# EasyEDA Pro project Mini-Keyboard.eprj

# Schematic Schematic1
Board Name: Board1; Create Date: 2024-05-16; Page Name: P1; Project Name: Mini-Keyboard; Schematic Name: Schematic1; Update Date: 2024-11-25; Company: 嘉立创EDA; Page Size: A3; Version: V1.0
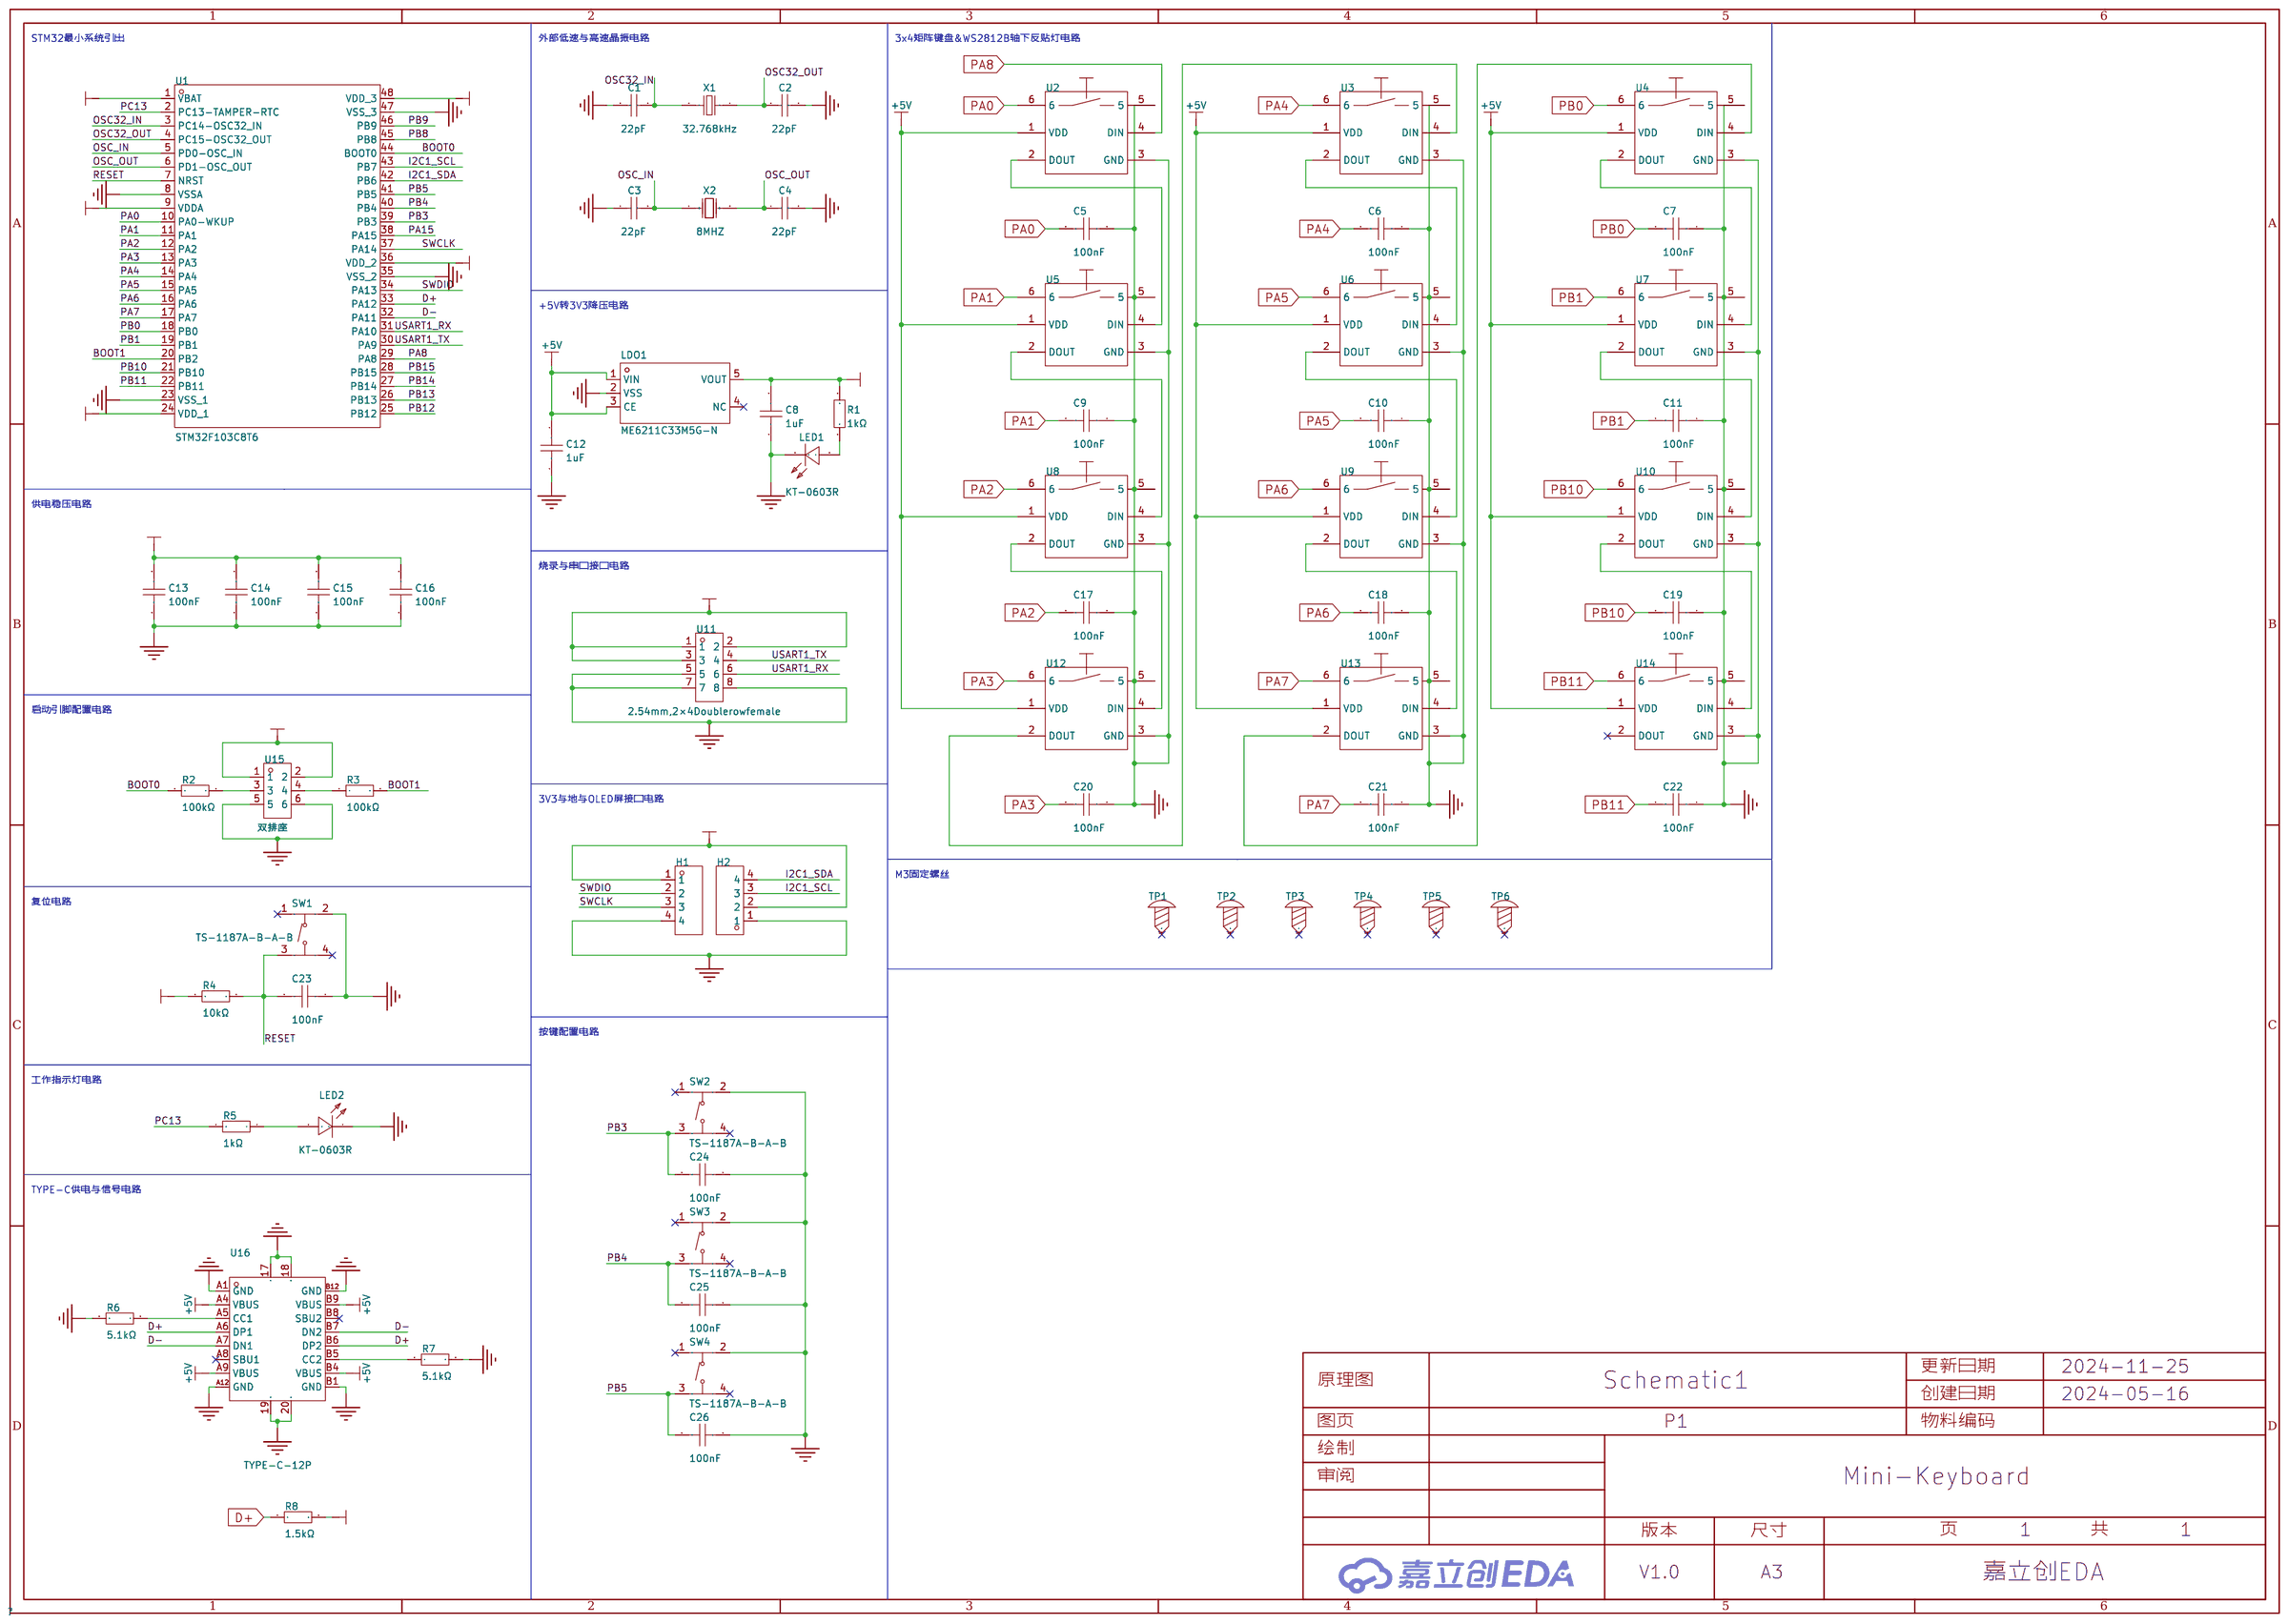
[diagram p0: schematic sheet]

## Parts
C1  22pF  [C0603]
C2  22pF  [C0603]
C3  22pF  [C0603]
C4  22pF  [C0603]
C5  100nF  [C0603]
C6  100nF  [C0603]
C7  100nF  [C0603]
C8  1uF  [C0603]
C9  100nF  [C0603]
C10  100nF  [C0603]
C11  100nF  [C0603]
C12  1uF  [C0603]
C13  100nF  [C0603]
C14  100nF  [C0603]
C15  100nF  [C0603]
C16  100nF  [C0603]
C17  100nF  [C0603]
C18  100nF  [C0603]
C19  100nF  [C0603]
C20  100nF  [C0603]
C21  100nF  [C0603]
C22  100nF  [C0603]
C23  100nF  [C0603]
C24  100nF  [C0603]
C25  100nF  [C0603]
C26  100nF  [C0603]
H1  -  [hdr-th_4p-p2.54-v-f]
H2  -  [hdr-th_4p-p2.54-v-f]
LDO1  ME6211C33M5G-N  [SOT-23-5_L3.0-W1.7-P0.95-LS2.8-BL]
LED1  KT-0603R  [LED0603-RD]
LED2  KT-0603R  [LED0603-RD]
R1  1kΩ  [R0603]
R2  100kΩ  [R0603]
R3  100kΩ  [R0603]
R4  10kΩ  [R0603]
R5  1kΩ  [R0603]
R6  5.1kΩ  [R0603]
R7  5.1kΩ  [R0603]
R8  1.5kΩ  [R0603]
SW1  TS-1187A-B-A-B  [SW-SMD_4P-L5.1-W5.1-P3.70-LS6.5-TL-2]
SW2  TS-1187A-B-A-B  [SW-SMD_4P-L5.1-W5.1-P3.70-LS6.5-TL-2]
SW3  TS-1187A-B-A-B  [SW-SMD_4P-L5.1-W5.1-P3.70-LS6.5-TL-2]
SW4  TS-1187A-B-A-B  [SW-SMD_4P-L5.1-W5.1-P3.70-LS6.5-TL-2]
TP1  -  [M3螺丝]
TP2  -  [M3螺丝]
TP3  -  [M3螺丝]
TP4  -  [M3螺丝]
TP5  -  [M3螺丝]
TP6  -  [M3螺丝]
U1  STM32F103C8T6  [LQFP-48_L7.0-W7.0-P0.50-LS9.0-BL]
U2  -  [KAILH_WS2182B_3528 反贴]
U3  -  [KAILH_WS2182B_3528 反贴]
U4  -  [KAILH_WS2182B_3528 反贴]
U5  -  [KAILH_WS2182B_3528 反贴]
U6  -  [KAILH_WS2182B_3528 反贴]
U7  -  [KAILH_WS2182B_3528 反贴]
U8  -  [KAILH_WS2182B_3528 反贴]
U9  -  [KAILH_WS2182B_3528 反贴]
U10  -  [KAILH_WS2182B_3528 反贴]
U11  2.54mm,2×4Doublerowfemale  [HDR-TH_8P-P2.54-V-F-R2-C4-S2.54-1]
U12  -  [KAILH_WS2182B_3528 反贴]
U13  -  [KAILH_WS2182B_3528 反贴]
U14  -  [KAILH_WS2182B_3528 反贴]
U15  双排座  [HDR-TH_6P-P2.54-V-F-R2-C3-S2.54]
U16  TYPE-C-12P  [USB-SMD_TYPE-C16PIN]
X1  32.768kHz  [CRYSTAL-SMD_L3.2-W1.5-1]
X2  8MHZ  [HC-49S_L11.5-W5.0-P4.88]

## Library data of the parts
C1-C4 = CL10C220JB8NNNC: 容值:22pF;精度:±5%;额定电压:50V;材质(温度系数):C0G;; LCSC Part Name: 22pF ±5% 50V; Supplier Part: C1653; Manufacturer: SAMSUNG(三星); Supplier Footprint: 0603; JLCPCB Part Class: 基础库; Datasheet: https://atta.szlcsc.com/upload/public/pdf/source/20160218/1457707763339.pdf; Supplier: LCSC; Tolerance: ±5%; Voltage Rated: 50V; Temperature Coefficient: C0G
C5-C7 C9-C11 C13-C26 = CC0603KRX7R9BB104: 容值:100nF;精度:±10%;额定电压:50V;材质(温度系数):X7R;; LCSC Part Name: 100nF ±10% 50V; Supplier Part: C14663; Manufacturer: YAGEO(国巨); Supplier Footprint: 0603; JLCPCB Part Class: 基础库; Datasheet: https://atta.szlcsc.com/upload/public/pdf/source/20180910/C282072_33301C7F631E79921B82A8DAC6BCC5B3.pdf; Supplier: LCSC; Tolerance: ±10%; Voltage Rated: 50V; Temperature Coefficient: X7R
C8 C12 = CL10A105KB8NNNC: 容值:1uF;精度:±10%;额定电压:50V;材质(温度系数):X5R;; LCSC Part Name: 1uF ±10% 50V; Supplier Part: C15849; Manufacturer: SAMSUNG(三星); Supplier Footprint: 0603; JLCPCB Part Class: 基础库; Datasheet: https://atta.szlcsc.com/upload/public/pdf/source/20160218/1457707763339.pdf; Supplier: LCSC; Tolerance: ±10%; Voltage Rated: 50V; Temperature Coefficient: X5R
H1 H2 = HDR-F_2.54_1x4P: Supplier Part: C2718488; Supplier Footprint: 插件; JLCPCB Part Class: 扩展库
LDO1 = ME6211C33M5G-N: 输出类型:固定;最大输入电压:6V;输出电压:3.3V;最大输出电流:500mA;电源纹波抑制比(PSRR):70dB;输出极性:正极;; LCSC Part Name: 输入6V 输出3.3V 500mA; Supplier Part: C82942; Manufacturer: MICRONE(南京微盟); Supplier Footprint: SOT-23-5; JLCPCB Part Class: 扩展库; Datasheet: https://atta.szlcsc.com/upload/public/pdf/source/20170918/C82942_1505727073070976520.pdf; Supplier: LCSC; Output Type: 固定; Maximum Input Voltage: 6V; Output Voltage: 3.3V; MAX Output Current: 500mA; Power Supply Rejection Ratio (PSRR): 70dB; Dropout Voltage: 260mV@(200mA); Output Polarity: 正极; Number of Outputs: 1
LED1 LED2 = KT-0603R: 发光颜色:红色;功率:-;正向电流:-;主波长:-;二极管配置:-;透镜颜色:-;色温:-;发光角度:-;载带方式:-;工作温度:-40℃~+85℃;; LCSC Part Name: 0603 红灯 高亮; Supplier Part: C2286; Manufacturer: KENTO; Supplier Footprint: 0603; JLCPCB Part Class: 基础库; Datasheet: https://atta.szlcsc.com/upload/public/pdf/source/20160616/1466072038404.pdf; Supplier: LCSC; Emitted Color: 红色; Operating Temperature: -40℃~+85℃
R1 R5 = 0603WAF1001T5E: 电阻类型:厚膜电阻;阻值:1kΩ;精度:±1%;功率:100mW;最大工作电压:75V;温度系数:±100ppm/℃;; LCSC Part Name: 1kΩ ±1% 100mW 厚膜电阻; Supplier Part: C21190; Manufacturer: UNI-ROYAL(厚声); Supplier Footprint: 0603; JLCPCB Part Class: 基础库; Datasheet: https://atta.szlcsc.com/upload/public/pdf/source/20200306/C422600_1E6D84923E4A46A82E41ADD87F860B5C.pdf; Supplier: LCSC; Type: 厚膜电阻; Tolerance: ±1%; Power(Watts): 100mW; Overload Voltage (Max): 75V; Temperature Coefficient: ±100ppm/℃; Operating Temperature Range: -55℃~+155℃
R2 R3 = 0603WAF1003T5E: 电阻类型:厚膜电阻;阻值:100kΩ;精度:±1%;功率:100mW;最大工作电压:75V;温度系数:±100ppm/℃;; LCSC Part Name: 100kΩ ±1% 100mW 厚膜电阻; Supplier Part: C25803; Manufacturer: UNI-ROYAL(厚声); Supplier Footprint: 0603; JLCPCB Part Class: 基础库; Datasheet: https://atta.szlcsc.com/upload/public/pdf/source/20200306/C422600_1E6D84923E4A46A82E41ADD87F860B5C.pdf; Supplier: LCSC; Type: 厚膜电阻; Tolerance: ±1%; Power(Watts): 100mW; Overload Voltage (Max): 75V; Temperature Coefficient: ±100ppm/℃; Operating Temperature Range: -55℃~+155℃
R4 = 0603WAF1002T5E: 电阻类型:厚膜电阻;阻值:10kΩ;精度:±1%;功率:100mW;最大工作电压:75V;温度系数:±100ppm/℃;; LCSC Part Name: 厚膜电阻 10kΩ ±1% 100mW; Supplier Part: C25804; Manufacturer: UNI-ROYAL(厚声); Supplier Footprint: 0603; JLCPCB Part Class: 基础库; Datasheet: https://atta.szlcsc.com/upload/public/pdf/source/20200306/C422600_1E6D84923E4A46A82E41ADD87F860B5C.pdf; Supplier: LCSC; Type: 厚膜电阻; Tolerance: ±1%; Power(Watts): 100mW; Overload Voltage (Max): 75V; Temperature Coefficient: ±100ppm/℃; Operating Temperature Range: -55℃~+155℃
R6 R7 = 0603WAF5101T5E: 电阻类型:厚膜电阻;阻值:5.1kΩ;精度:±1%;功率:100mW;最大工作电压:75V;温度系数:±100ppm/℃;; LCSC Part Name: 5.1kΩ ±1% 100mW 厚膜电阻; Supplier Part: C23186; Manufacturer: UNI-ROYAL(厚声); Supplier Footprint: 0603; JLCPCB Part Class: 基础库; Datasheet: https://atta.szlcsc.com/upload/public/pdf/source/20200306/C422600_1E6D84923E4A46A82E41ADD87F860B5C.pdf; Supplier: LCSC; Type: 厚膜电阻; Tolerance: ±1%; Power(Watts): 100mW; Overload Voltage (Max): 75V; Temperature Coefficient: ±100ppm/℃; Operating Temperature Range: -55℃~+155℃
R8 = 0603WAF1501T5E: 电阻类型:厚膜电阻;阻值:1.5kΩ;精度:±1%;功率:100mW;最大工作电压:75V;温度系数:±100ppm/℃;; LCSC Part Name: 1.5kΩ ±1% 100mW 厚膜电阻; Supplier Part: C22843; Manufacturer: UNI-ROYAL(厚声); Supplier Footprint: 0603; JLCPCB Part Class: 基础库; Datasheet: https://atta.szlcsc.com/upload/public/pdf/source/20200306/C422600_1E6D84923E4A46A82E41ADD87F860B5C.pdf; Supplier: LCSC; Type: 厚膜电阻; Tolerance: ±1%; Power(Watts): 100mW; Overload Voltage (Max): 75V; Temperature Coefficient: ±100ppm/℃; Operating Temperature Range: -55℃~+155℃
SW1-SW4 = TS-1187A-B-A-B: 电路结构:单刀单掷;按钮形状:圆形按钮;作用力:160gf;安装方式:立贴;开关长度:5.1mm;开关宽度:5.1mm;开关高度:1.5mm;带支架:不带;触点电流:50mA;额定电压(DC):12V;绝缘电阻:-;带灯:无;机械寿命:10万次;; LCSC Part Name: 5.1*5.1*1.5mm 立贴 轻触开关; Supplier Part: C318884; Manufacturer: XKB Connectivity(中国星坤); Supplier Footprint: SMD; JLCPCB Part Class: 基础库; Datasheet: https://atta.szlcsc.com/upload/public/pdf/source/20200227/C318890_053E50208A88A7BA1965D8746000774E.pdf; Supplier: LCSC; Circuit: 单刀单掷; Actuator Style: 圆形按钮; Operating Force: 160gf; Mounting Style: 立贴; Switch Length: 5.1mm; Switch Width: 5.1mm; Switch Height: 1.5mm; Strike Gundam: 不带; Contact Current: 50mA; Voltage Rating (DC): 12V; Actuator/Cap Color: 金色; With Lamp: 无; Mechanical Life: 10万次; Operating Temperature: -30℃~+85℃
TP1-TP6 = M3螺丝: Supplier Footprint: 插件
U1 = STM32F103C8T6: CPU内核:ARM-M3;程序存储容量:64KB;RAM总容量:20KB;GPIO端口数量:37;工作电压范围:2V~3.6V;CPU最大主频:72MHz;程序存储器类型:FLASH;; Supplier Part: C8734; Manufacturer: ST(意法半导体); Supplier Footprint: LQFP-48(7x7); JLCPCB Part Class: 扩展库; Datasheet: https://atta.szlcsc.com/upload/public/pdf/source/20220812/8363ACEC51AD55ECEB84799464F7CB85.pdf; Supplier: LCSC; CPU Core: ARM-M3; Program Storage Size: 64KB; RAM Size: 20KB; GPIO Ports Number: 37; Operating Voltage Range: 2V~3.6V; CPU Maximum Speed: 72MHz; Program Memory Type: FLASH; Operating Temperature Range: -40℃~+85℃; ADC (Bit): 12bit; Universal Serial Bus: 有; Peripheral/Function: 看门狗；DMA；看门狗；温度传感器; Watchdog: 有; Infrared Data Association: 有; Low-Voltage Detect: 有; Direct Memory Access: 有; Internal Oscillator: 有
U2-U10 U12-U14 = KAILH_WS2182B_3528 反贴
U11 = 2.54mm,2×4Doublerowfemale: Supplier Part: C9900004313; JLCPCB Part Class: 扩展库; Supplier: LCSC
U15 = 双排座: Supplier Part: C9900022466; Supplier Footprint: HDR-TH-6P; JLCPCB Part Class: 扩展库; Supplier: LCSC
U16 = TYPE-C-12P: Supplier Part: C9900014866; Supplier Footprint: USB_TypeC; JLCPCB Part Class: 扩展库; Supplier: LCSC
X1 = FC31M2-32.768-NTLLLDT: 晶振类型:贴片晶振;频率:32.768kHz;常温频差:±20ppm;外接负载电容:12.5pF;频率稳定度(全温):±20ppm;; LCSC Part Name: 32.768kHz ±20ppm 12.5pF; Supplier Part: C2842180; Manufacturer: HCI(杭晶); Supplier Footprint: SMD3215-2P; JLCPCB Part Class: 扩展库; Datasheet: https://atta.szlcsc.com/upload/public/pdf/source/20220525/2E044CF849361D91E29045F083201687.pdf; Supplier: LCSC; Crystal Type: 贴片晶振; Normal temperature Frequency Tolerance: ±20ppm; External load capacitor: 12.5pF; Frequency Stability(Full temperature range): ±20ppm; Equivalent Series Resistance (ESR): 50kΩ; Operating Temperature: -40℃~+85℃
X2 = 8MHZ: Supplier Part: C9900021358; Supplier Footprint: X-HC49U直插; JLCPCB Part Class: 扩展库; Supplier: LCSC

## Nets
3V3: C8.2 C13.2 C14.2 C15.2 C16.2 H1.1 H2.2 LDO1.5(VOUT) R1.2 R4.2 R8.2 U1.1(VBAT) U1.9(VDDA) U1.24(VDD_1) U1.36(VDD_2) U1.48(VDD_3) U11.1 U11.2 U11.3 U15.1 U15.2
+5V: C12.2 LDO1.1(VIN) LDO1.3(CE) U2.1(VDD) U3.1(VDD) U4.1(VDD) U5.1(VDD) U6.1(VDD) U7.1(VDD) U8.1(VDD) U9.1(VDD) U10.1(VDD) U12.1(VDD) U13.1(VDD) U14.1(VDD) U16.A4(VBUS) U16.A9(VBUS) U16.B4(VBUS) U16.B9(VBUS)
GND: C1.1 C2.1 C3.1 C4.2 C5.1 C6.1 C7.1 C8.1 C9.1 C10.1 C11.1 C12.1 C13.1 C14.1 C15.1 C16.1 C17.1 C18.1 C19.1 C20.1 C21.1 C22.1 C23.1 C24.1 C25.1 C26.1 H1.4 H2.1 LDO1.2(VSS) LED1.1(K) LED2.1(K) R6.1 R7.2 SW1.2(B) SW2.2(B) SW3.2(B) SW4.2(B) U1.8(VSSA) U1.23(VSS_1) U1.35(VSS_2) U1.47(VSS_3) U2.3(GND) U2.5 U3.3(GND) U3.5 U4.3(GND) U4.5 U5.3(GND) U5.5 U6.3(GND) U6.5 U7.3(GND) U7.5 U8.3(GND) U8.5 U9.3(GND) U9.5 U10.3(GND) U10.5 U11.5 U11.7 U11.8 U12.3(GND) U12.5 U13.3(GND) U13.5 U14.3(GND) U14.5 U15.5 U15.6 U16.17 U16.18 U16.19 U16.20 U16.A1(GND) U16.A12(GND) U16.B1(GND) U16.B12(GND)
BOOT0: R2.1 U1.44(BOOT0)
BOOT1: R3.2 U1.20(PB2)
D+: R8.1 U1.33(PA12) U16.A6(DP1) U16.B6(DP2)
D-: U1.32(PA11) U16.A7(DN1) U16.B7(DN2)
I2C1_SCL: H2.3 U1.43(PB7)
I2C1_SDA: H2.4 U1.42(PB6)
OSC32_IN: C1.2 U1.3(PC14-OSC32_IN) X1.2
OSC32_OUT: C2.2 U1.4(PC15-OSC32_OUT) X1.1
OSC_IN: C3.2 U1.5(PD0-OSC_IN) X2.1(OSC1)
OSC_OUT: C4.1 U1.6(PD1-OSC_OUT) X2.2(OSC2)
PA0: C5.2 U1.10(PA0-WKUP) U2.6
PA1: C9.2 U1.11(PA1) U5.6
PA2: C17.2 U1.12(PA2) U8.6
PA3: C20.2 U1.13(PA3) U12.6
PA4: C6.2 U1.14(PA4) U3.6
PA5: C10.2 U1.15(PA5) U6.6
PA6: C18.2 U1.16(PA6) U9.6
PA7: C21.2 U1.17(PA7) U13.6
PA8: U1.29(PA8) U2.4(DIN)
PA15: U1.38(PA15)
PB0: C7.2 U1.18(PB0) U4.6
PB1: C11.2 U1.19(PB1) U7.6
PB3: C24.2 SW2.3(C) U1.39(PB3)
PB4: C25.2 SW3.3(C) U1.40(PB4)
PB5: C26.2 SW4.3(C) U1.41(PB5)
PB8: U1.45(PB8)
PB9: U1.46(PB9)
PB10: C19.2 U1.21(PB10) U10.6
PB11: C22.2 U1.22(PB11) U14.6
PB12: U1.25(PB12)
PB13: U1.26(PB13)
PB14: U1.27(PB14)
PB15: U1.28(PB15)
PC13: R5.2 U1.2(PC13-TAMPER-RTC)
RESET: C23.2 R4.1 SW1.3(C) U1.7(NRST)
SWCLK: H1.3 U1.37(PA14)
SWDIO: H1.2 U1.34(PA13)
USART1_RX: U1.31(PA10) U11.6
USART1_TX: U1.30(PA9) U11.4
$1N2502: LED2.2(A) R5.1
$1N8138: R2.2 U15.3
$1N8141: R3.1 U15.4
$1N12765: LED1.2(A) R1.1
$1N28341: R6.2 U16.A5(CC1)
$1N28394: R7.1 U16.B5(CC2)
$1N31642: U2.2(DOUT) U5.4(DIN)
$1N31651: U5.2(DOUT) U8.4(DIN)
$1N31657: U8.2(DOUT) U12.4(DIN)
$1N31663: U3.2(DOUT) U6.4(DIN)
$1N31669: U6.2(DOUT) U9.4(DIN)
$1N31675: U9.2(DOUT) U13.4(DIN)
$1N31681: U4.2(DOUT) U7.4(DIN)
$1N31687: U7.2(DOUT) U10.4(DIN)
$1N31693: U10.2(DOUT) U14.4(DIN)
$1N32081: U3.4(DIN) U12.2(DOUT)
$1N32103: U4.4(DIN) U13.2(DOUT)

Not connected (* = marked no-connect by the designer): LDO1 4(NC)*; SW1 1(A)* 4(D)*; SW2 1(A)* 4(D)*; SW3 1(A)* 4(D)*; SW4 1(A)* 4(D)*; TP1 1*; TP2 1*; TP3 1*; TP4 1*; TP5 1*; TP6 1*; U14 2(DOUT)*; U16 A8(SBU1)* B8(SBU2)*

## Notes on the sheet
- STM32最小系统引出
- 外部低速与高速晶振电路
- 3x4矩阵键盘&WS2812B轴下反贴灯电路
- +5V转3V3降压电路
- 供电稳压电路
- 烧录与串口接口电路
- 启动引脚配置电路
- 3V3与地与OLED屏接口电路
- M3固定螺丝
- 复位电路
- 按键配置电路
- 工作指示灯电路
- TYPE-C供电与信号电路

# Board PCB1
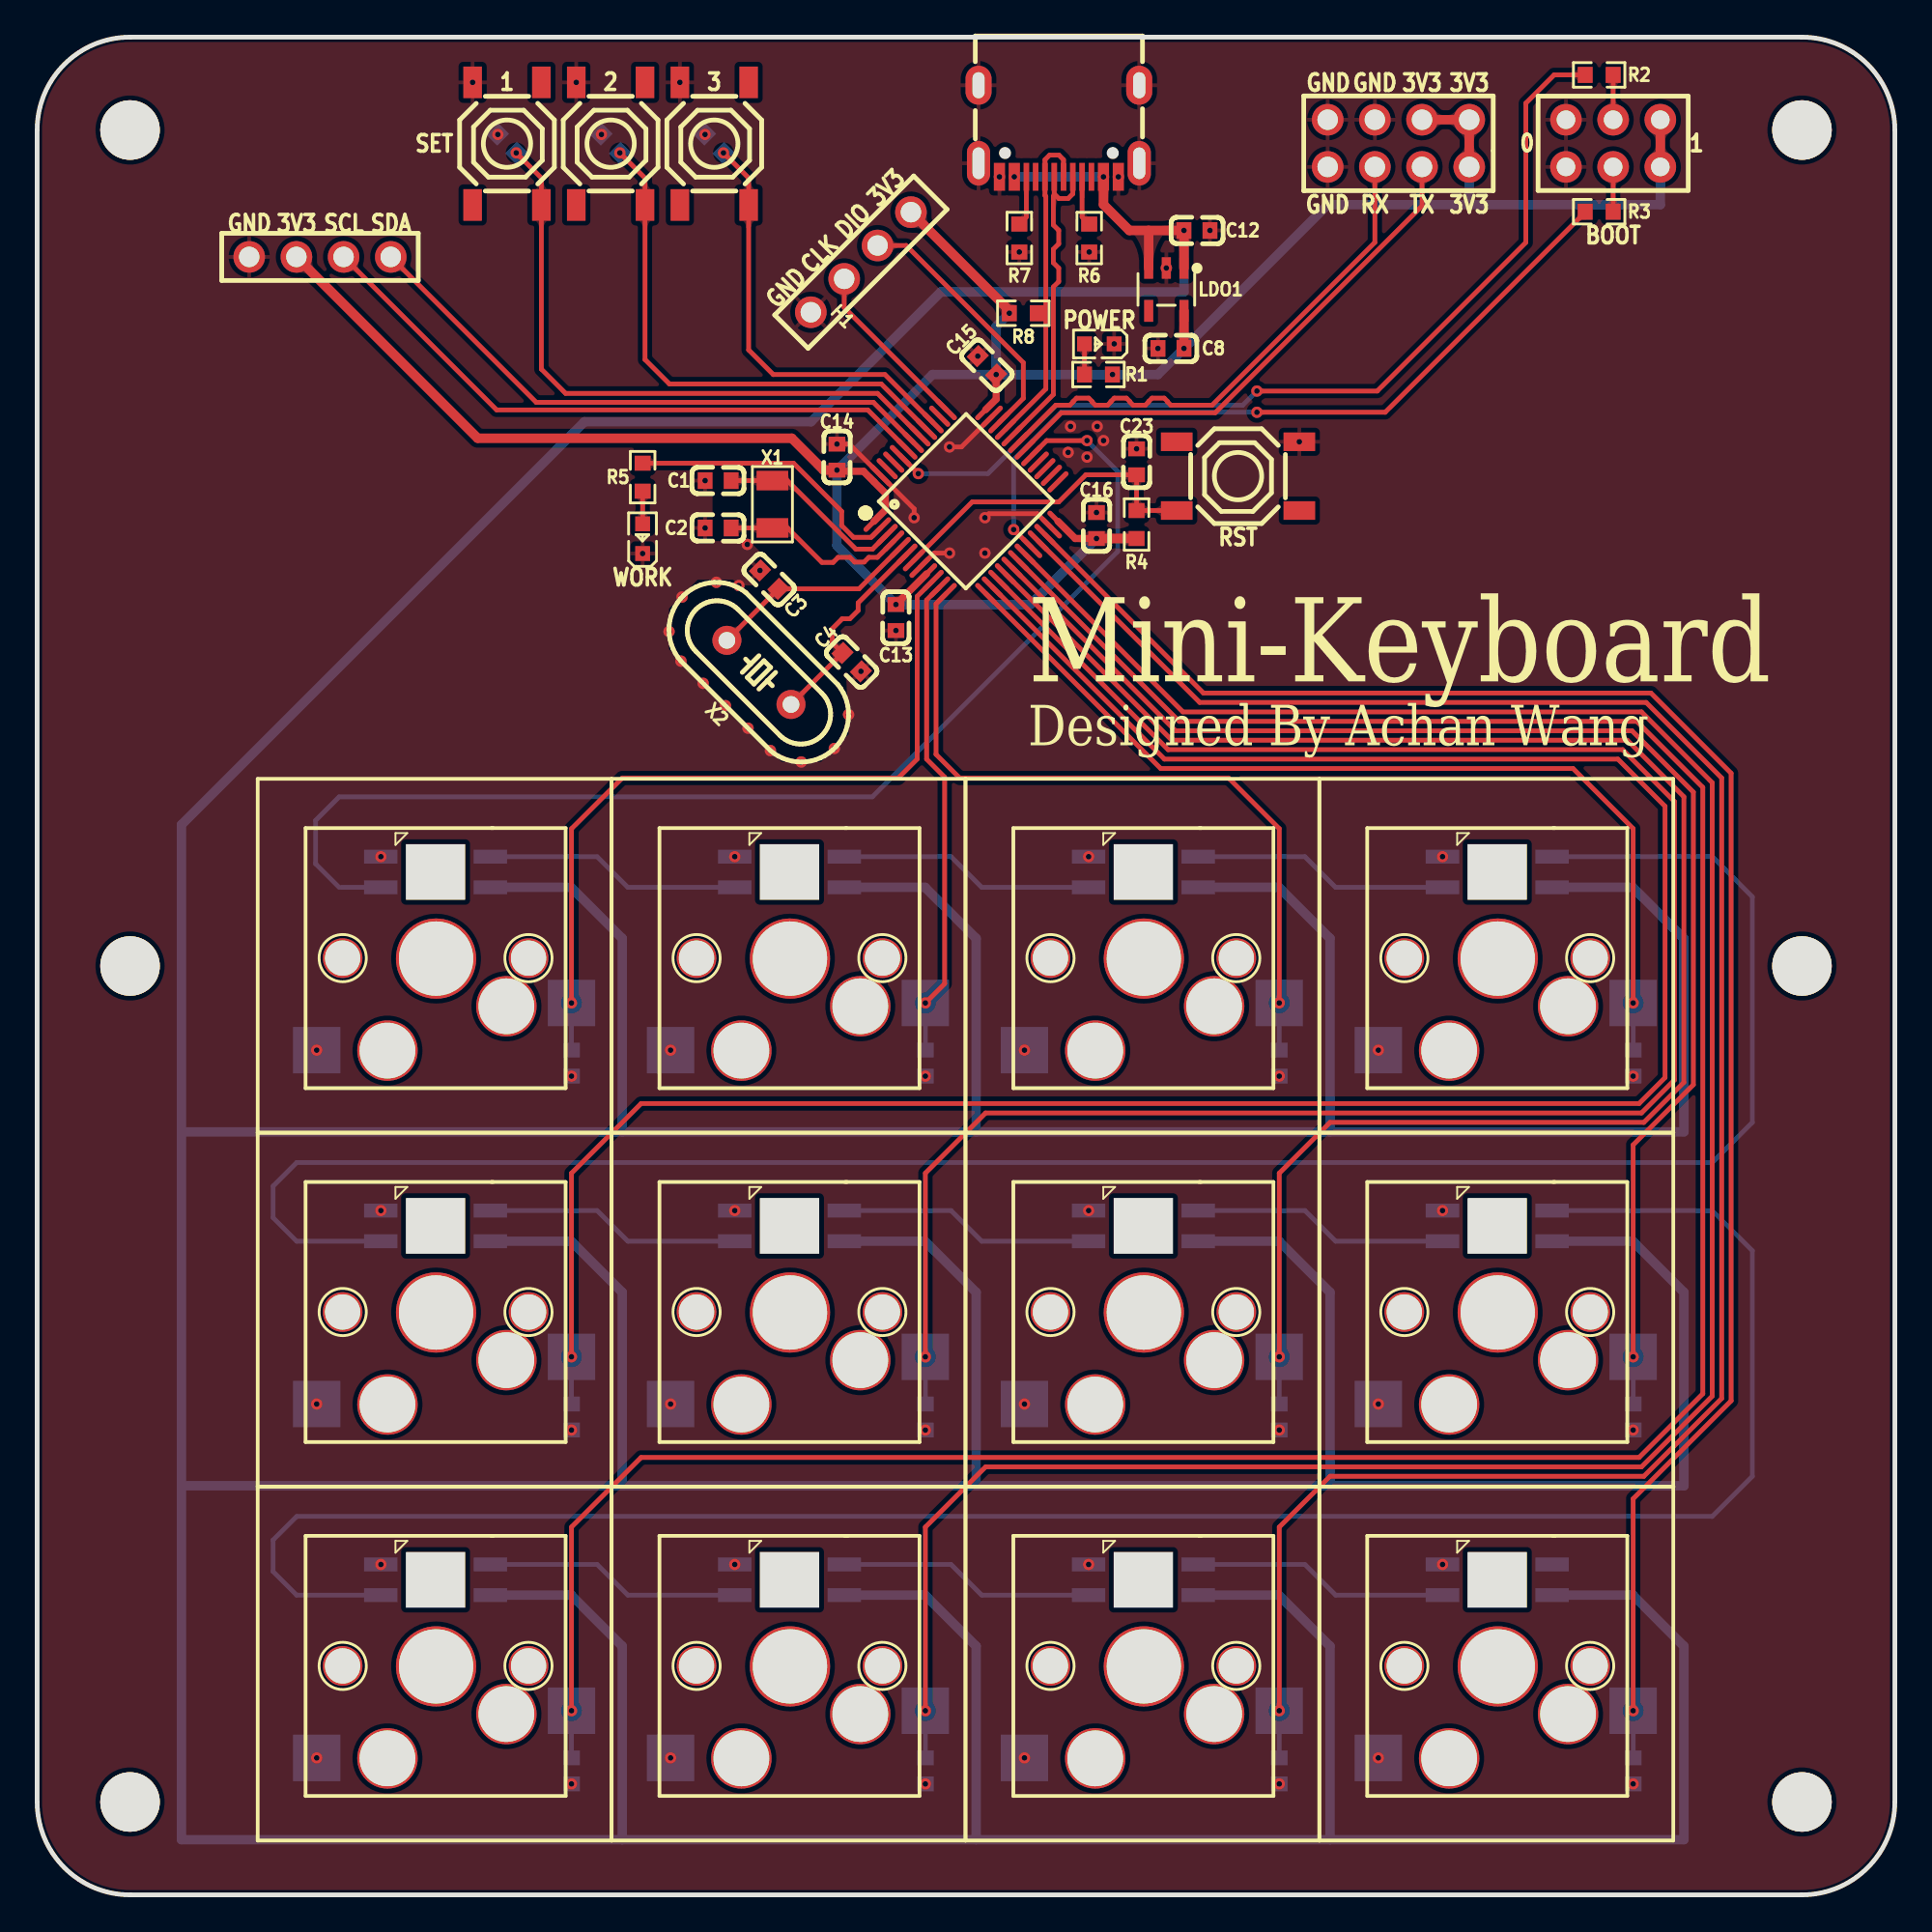
[diagram p1: board, top side]
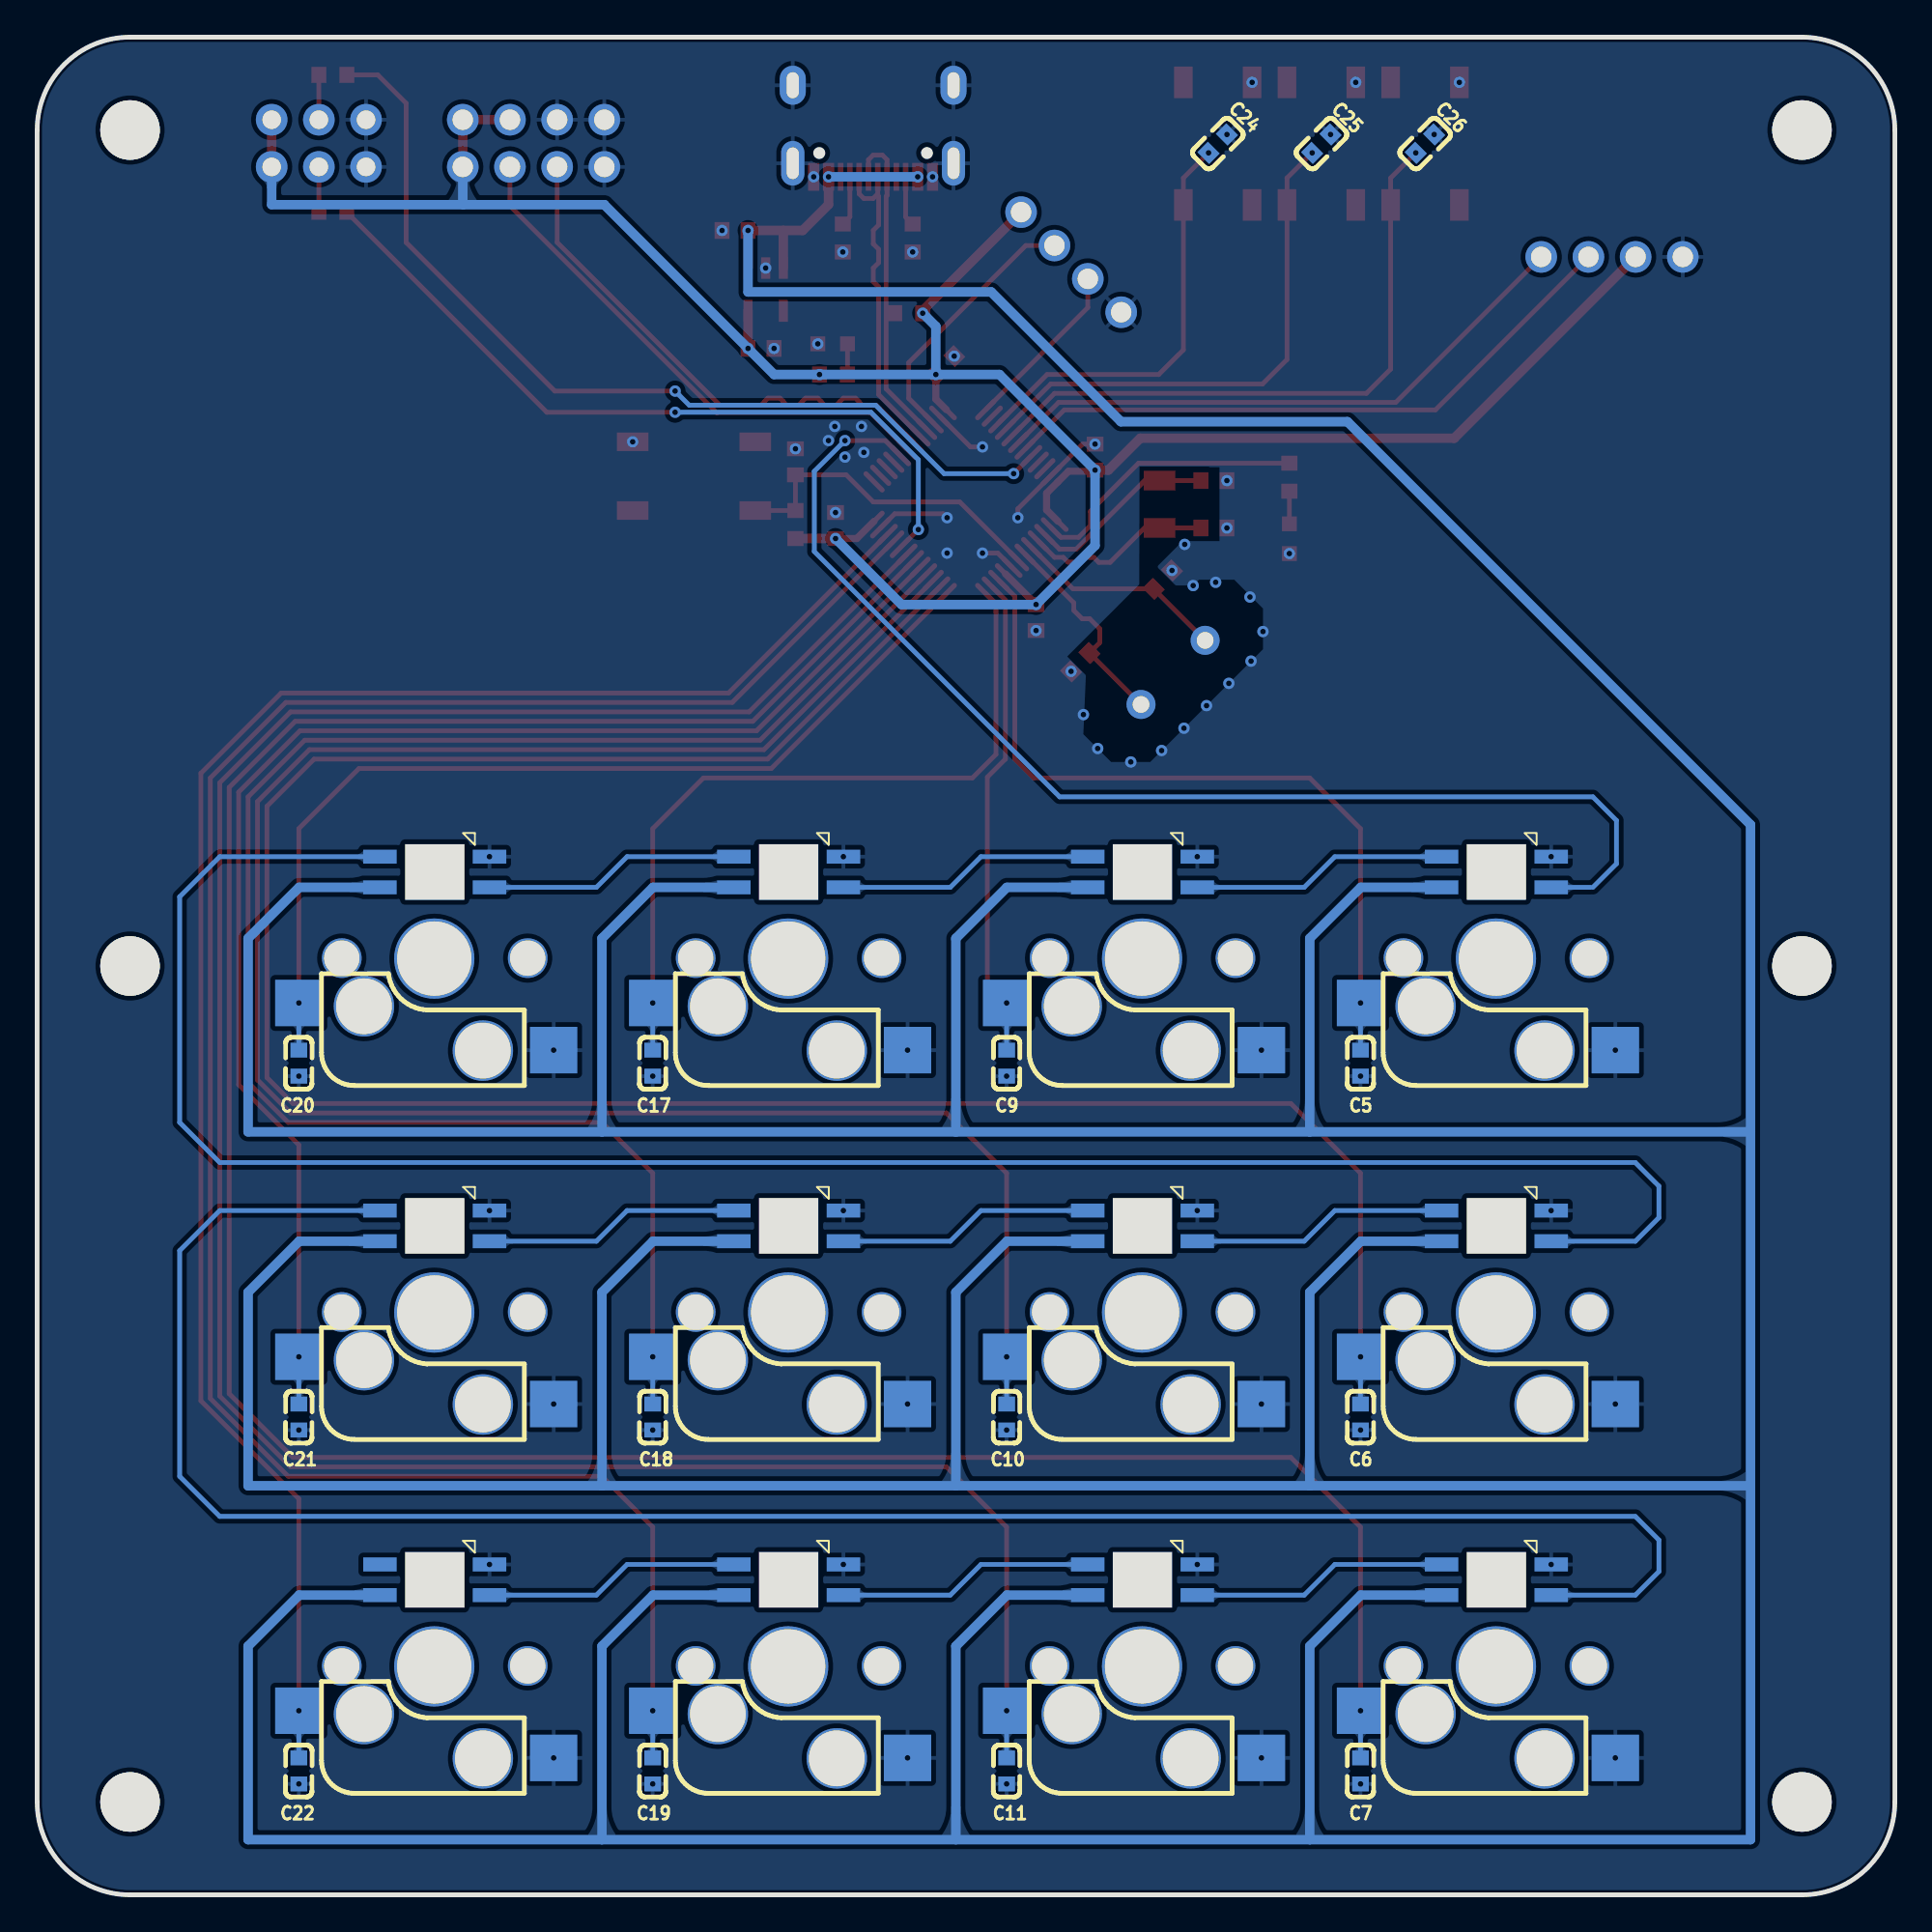
[diagram p2: board, bottom side, seen from below]

Outline 100 x 100 mm; copper layers: Top Layer, Bottom Layer. Coordinates in mm from the lower left corner of the outline.
Outline path: 0,95 0,5 arc(1.46,1.46) 5,0 95,0 arc(98.54,1.46) 100,5 100,95 arc(98.54,98.54) 95,100 5,100 arc(1.46,98.54) 0,95
Stack: Top Layer 0.035mm / Dielectric1 1.51mm FR4 er 4.5 / Bottom Layer 0.035mm

## Design rules (mm)
net OSC32_IN: DP3
net OSC32_OUT: DP3
net OSC_IN: DP2
net OSC_OUT: DP2
net USART1_TX: DP4
net USART1_RX: DP4
net D-: DP1
net D+: DP1
template: 自定义配置
spacing copperThickness1oz (default): track to track 0.102, other pairs 0.152 to 0.3
spacing copperThickness2oz: track to track 0.203, other pairs 0.152 to 0.3
track width copperThickness1oz (default): min 0.127, default 0.254, max 2.54
track width copperThickness2oz: min 0.203, default 0.254, max 2.54
track width Power: min 0.127, default 0.508, max 2.54
differential pair differentialPair (default): width min 0.127, default 0.254, max 2.54; gap min 0.152, default 0.152
via viaSize (default): diameter min 0.5, default 0.61, max 10; hole min 0.3, default 0.305, max 6.299
net GND uses Power
net 3V3 uses Power
net +5V uses Power

## Placement (name value [footprint] x y rotation side)
C1  22pF  [C0603]  36.66 76.13 0 top
C2  22pF  [C0603]  36.66 73.58 0 top
C3  22pF  [C0603]  39.41 70.8 315 top
C4  22pF  [C0603]  43.85 66.36 315 top
C5  100nF  [C0603]  28.76 44.77 90 bottom
C6  100nF  [C0603]  28.76 25.72 90 bottom
C7  100nF  [C0603]  28.76 6.67 90 bottom
C8  1uF  [C0603]  61.03 83.24 0 top
C9  100nF  [C0603]  47.81 44.77 90 bottom
C10  100nF  [C0603]  47.81 25.72 90 bottom
C11  100nF  [C0603]  47.81 6.67 90 bottom
C12  1uF  [C0603]  62.43 89.59 180 top
C13  100nF  [C0603]  46.23 68.76 90 top
C14  100nF  [C0603]  43.05 77.39 270 top
C15  100nF  [C0603]  51.13 82.33 315 top
C16  100nF  [C0603]  57.02 73.71 270 top
C17  100nF  [C0603]  66.86 44.77 90 bottom
C18  100nF  [C0603]  66.86 25.72 90 bottom
C19  100nF  [C0603]  66.86 6.67 90 bottom
C20  100nF  [C0603]  85.91 44.77 90 bottom
C21  100nF  [C0603]  85.91 25.72 90 bottom
C22  100nF  [C0603]  85.91 6.67 90 bottom
C23  100nF  [C0603]  59.18 77.14 270 top
C24  100nF  [C0603]  36.45 94.27 315 bottom
C25  100nF  [C0603]  30.87 94.27 315 bottom
C26  100nF  [C0603]  25.29 94.27 315 bottom
H1  -  [hdr-th_4p-p2.54-v-f]  44.34 87.89 225 top
H2  -  [hdr-th_4p-p2.54-v-f]  15.22 88.17 0 top
LDO1  ME6211C33M5G-N  [SOT-23-5_L3.0-W1.7-P0.95-LS2.8-BL]  60.78 86.42 180 top
LED1  KT-0603R  [LED0603-RD]  57.18 83.49 180 top
LED2  KT-0603R  [LED0603-RD]  32.59 73 90 top
R1  1kΩ  [R0603]  57.13 81.84 0 top
R2  100kΩ  [R0603]  84.08 97.97 0 top
R3  100kΩ  [R0603]  84.08 90.6 180 top
R4  10kΩ  [R0603]  59.18 73.76 270 top
R5  1kΩ  [R0603]  32.59 76.31 90 top
R6  5.1kΩ  [R0603]  56.63 89.19 90 top
R7  5.1kΩ  [R0603]  52.87 89.19 270 top
R8  1.5kΩ  [R0603]  53.09 85.14 180 top
SW1  TS-1187A-B-A-B  [SW-SMD_4P-L5.1-W5.1-P3.70-LS6.5-TL-2]  64.64 76.37 0 top
SW2  TS-1187A-B-A-B  [SW-SMD_4P-L5.1-W5.1-P3.70-LS6.5-TL-2]  36.45 94.27 90 top
SW3  TS-1187A-B-A-B  [SW-SMD_4P-L5.1-W5.1-P3.70-LS6.5-TL-2]  30.87 94.27 90 top
SW4  TS-1187A-B-A-B  [SW-SMD_4P-L5.1-W5.1-P3.70-LS6.5-TL-2]  25.29 94.27 90 top
TP1  -  [M3螺丝]  5.06 94.94 0 top
TP2  -  [M3螺丝]  5.06 49.94 0 top
TP3  -  [M3螺丝]  5.06 4.94 0 top
TP4  -  [M3螺丝]  95.06 4.94 0 top
TP5  -  [M3螺丝]  95.06 49.94 0 top
TP6  -  [M3螺丝]  95.06 94.94 0 top
U1  STM32F103C8T6  [LQFP-48_L7.0-W7.0-P0.50-LS9.0-BL]  50 75 315 top
U2  -  [KAILH_WS2182B_3528 反贴]  21.45 50.42 0 top
U3  -  [KAILH_WS2182B_3528 反贴]  21.45 31.37 0 top
U4  -  [KAILH_WS2182B_3528 反贴]  21.45 12.32 0 top
U5  -  [KAILH_WS2182B_3528 反贴]  40.5 50.42 0 top
U6  -  [KAILH_WS2182B_3528 反贴]  40.5 31.37 0 top
U7  -  [KAILH_WS2182B_3528 反贴]  40.5 12.32 0 top
U8  -  [KAILH_WS2182B_3528 反贴]  59.55 50.42 0 top
U9  -  [KAILH_WS2182B_3528 反贴]  59.55 31.37 0 top
U10  -  [KAILH_WS2182B_3528 反贴]  59.55 12.32 0 top
U11  2.54mm,2×4Doublerowfemale  [HDR-TH_8P-P2.54-V-F-R2-C4-S2.54-1]  73.28 94.28 180 top
U12  -  [KAILH_WS2182B_3528 反贴]  78.6 50.42 0 top
U13  -  [KAILH_WS2182B_3528 反贴]  78.6 31.37 0 top
U14  -  [KAILH_WS2182B_3528 反贴]  78.6 12.32 0 top
U15  双排座  [HDR-TH_6P-P2.54-V-F-R2-C3-S2.54]  84.84 94.28 180 top
U16  TYPE-C-12P  [USB-SMD_TYPE-C16PIN]  55 95.05 180 top
X1  32.768kHz  [CRYSTAL-SMD_L3.2-W1.5-1]  39.58 74.85 90 top
X2  8MHZ  [HC-49S_L11.5-W5.0-P4.88]  38.85 65.8 315 top

## Footprints (pads in the part's own frame, mm; a bottom-side part is the same pattern mirrored in y, then rotated)
C0603
  rect 0.8x0.9 smd: 1(-0.7,0) 2(0.7,0)
CRYSTAL-SMD_L3.2-W1.5-1
  rect 1.05x1.7 smd: 1(-1.275,0) 2(1.275,0)
HC-49S_L11.5-W5.0-P4.88
  round 1.56 hole 0.9x0.53: 1(-2.44,0) 2(2.44,0)
hdr-th_4p-p2.54-v-f
  round 1.7 hole 1.1x0.89: 1(-3.81,0) 2(-1.27,0) 3(1.27,0) 4(3.81,0)
HDR-TH_6P-P2.54-V-F-R2-C3-S2.54
  round 1.7 hole 1x0.89: 1(-2.54,-1.27) 2(-2.54,1.27) 3(0,-1.27) 4(0,1.27) 5(2.54,-1.27) 6(2.54,1.27)
HDR-TH_8P-P2.54-V-F-R2-C4-S2.54-1
  round 1.7 hole 1.1x0.89: 1(-3.81,-1.27) 2(-3.81,1.27) 3(-1.27,-1.27) 4(-1.27,1.27) 5(1.27,-1.27) 6(1.27,1.27) 7(3.81,-1.27) 8(3.81,1.27)
KAILH_WS2182B_3528 反贴
  round 2.134 hole 1.9: (-5.004,0) (5.004,0)
  round 3.251 hole 3: (-2.591,-4.979) (3.81,-2.591)
  round 4.318 hole 4: (0.025,-0.025)
  rect 1.8x0.75 smd far side: 1(2.95,3.81) 2(2.95,5.461) 3(-2.95,5.461) 4(-2.95,3.81)
  rect 2.55x2.5 smd far side: 5(-6.401,-4.953) 6(7.315,-2.413)
LED0603-RD
  rect 0.8x0.8 smd: 1(-0.799,0) 2(0.799,0)
LQFP-48_L7.0-W7.0-P0.50-LS9.0-BL
  oval 0.27x1.5 smd: 1(-2.75,-4.25) 2(-2.25,-4.25) 3(-1.75,-4.25) 4(-1.25,-4.25) 5(-0.75,-4.25) 6(-0.25,-4.25) 7(0.25,-4.25) 8(0.75,-4.25) 9(1.25,-4.25) 10(1.75,-4.25) 11(2.25,-4.25) 12(2.75,-4.25) 25(2.75,4.25) 26(2.25,4.25) 27(1.75,4.25) 28(1.25,4.25) 29(0.75,4.25) 30(0.25,4.25) 31(-0.25,4.25) 32(-0.75,4.25) 33(-1.25,4.25) 34(-1.75,4.25) 35(-2.25,4.25) 36(-2.75,4.25)
  oval 1.5x0.27 smd: 13(4.25,-2.75) 14(4.25,-2.25) 15(4.25,-1.75) 16(4.25,-1.25) 17(4.25,-0.75) 18(4.25,-0.25) 19(4.25,0.25) 20(4.25,0.75) 21(4.25,1.25) 22(4.25,1.75) 23(4.25,2.25) 24(4.25,2.75) 37(-4.25,2.75) 38(-4.25,2.25) 39(-4.25,1.75) 40(-4.25,1.25) 41(-4.25,0.75) 42(-4.25,0.25) 43(-4.25,-0.25) 44(-4.25,-0.75) 45(-4.25,-1.25) 46(-4.25,-1.75) 47(-4.25,-2.25) 48(-4.25,-2.75)
M3螺丝
  round 3.2 hole 3.2: 1(-0.064,0.064)
R0603
  rect 0.806x0.864 smd: 1(-0.753,0) 2(0.753,0)
SOT-23-5_L3.0-W1.7-P0.95-LS2.8-BL
  rect 0.49x1.157 smd: 1(-0.95,-1.153) 2(0,-1.153) 3(0.95,-1.153)
  rect 0.49x1.175 smd: 4(0.95,1.153) 5(-0.95,1.153)
SW-SMD_4P-L5.1-W5.1-P3.70-LS6.5-TL-2
  rect 1.7x1 smd: 1(-3.3,1.85) 2(3.3,1.85) 3(-3.3,-1.85) 4(3.3,-1.85)
USB-SMD_TYPE-C16PIN
  oval 1.25x2.4 hole 0.65x1.7: 17(-4.325,1.835) 18(4.325,1.835)
  oval 1.4x2.1 hole 0.65x1.4: 19(-4.325,-2.365) 20(4.325,-2.365)
  rect 0.6x1.5 smd: A1(-3.2,2.565) A4(-2.4,2.565) A9(2.4,2.565) A12(3.2,2.565)
  rect 0.3x1.5 smd: A5(-1.25,2.565) A6(-0.25,2.565) A7(0.25,2.565) A8(1.25,2.565) B5(1.75,2.565) B6(0.75,2.565) B7(-0.75,2.565) B8(-1.75,2.565)

## Nets
As in the schematic, except:
+5V: C12.2 LDO1.1 LDO1.3 U2.1 U3.1 U4.1 U5.1 U6.1 U7.1 U8.1 U9.1 U10.1 U12.1 U13.1 U14.1 U16.A4 U16.A9
GND: C1.1 C2.1 C3.1 C4.2 C5.1 C6.1 C7.1 C8.1 C9.1 C10.1 C11.1 C12.1 C13.1 C14.1 C15.1 C16.1 C17.1 C18.1 C19.1 C20.1 C21.1 C22.1 C23.1 C24.1 C25.1 C26.1 H1.4 H2.1 LDO1.2 LED1.1 LED2.1 R6.1 R7.2 SW1.2 SW2.2 SW3.2 SW4.2 U1.8 U1.23 U1.35 U1.47 U2.3 U2.5 U3.3 U3.5 U4.3 U4.5 U5.3 U5.5 U6.3 U6.5 U7.3 U7.5 U8.3 U8.5 U9.3 U9.5 U10.3 U10.5 U11.5 U11.7 U11.8 U12.3 U12.5 U13.3 U13.5 U14.3 U14.5 U15.5 U15.6 U16.17 U16.18 U16.19 U16.20 U16.A1 U16.A12

Pads without a net: LDO1 4; SW1 1 4; SW2 1 4; SW3 1 4; SW4 1 4; TP1 1; TP2 1; TP3 1; TP4 1; TP5 1; TP6 1; U14 2; U16 A8 B8

## Via types
v1: diameter 0.61, hole 0.305, Top Layer to Bottom Layer, 114 vias

## Routing (per net, layer and track width the routed paths; a pad name or vN(x,y) marks a point on that pad's centre or on a via; arc(x,y) is an arc through that point)
3V3: length 143.7
  Top Layer w0.381: U1.1 45.66,74.55 45.66,75.45 U1.48 44.48,76.63 43.12,76.63 v1(43.05,76.69) ; v1(51.62,81.84) 51.62,80.51 U1.36 ; v1(46.23,69.46) 47.88,71.11 ; v1(57.02,73.01) 55.88,73.01 U1.24
  Top Layer w0.508: v1(52.33,85.14) 52.33,85.28 H1.1 ; v1(43.05,76.69) 42.33,76.69 40.62,78.41 23.72,78.41 H2.2 ; U11.2 77.09,95.56 74.55,95.56 ; 87.38,95.56 U15.2 ; v1(57.02,73.01) R4.2 ; LDO1.5 v1(61.73,83.24)
  Bottom Layer w0.508: v1(51.62,81.84) 48.2,81.84 v1(43.05,76.69) 43.05,72.63 v1(46.23,69.46) 53.47,69.46 v1(57.02,73.01) ; v1(51.62,81.84) 51.62,84.43 v1(52.33,85.14) ; v1(51.62,81.84) v1(57.89,81.84) 60.33,81.84 v1(61.73,83.24) 69.47,90.98 69.47,90.98 77.06,90.98 ; 77.06,90.98 87.38,90.98 87.38,92.89 ; 77.06,90.98 77.09,91.01 U11.2
+5V: length 606.1
  Top Layer w0.508: v1(57.4,92.48) 57.4,90.99 58.79,89.59 59.83,89.59 ; 59.83,89.59 LDO1.3 ; 59.83,89.59 C12.2 ; v1(61.73,89.59) LDO1.1
  Bottom Layer w0.508: 31.5,2.97 31.5,13.39 28.75,16.13 24.34,16.13 ; 31.5,2.97 50.55,2.97 ; 31.5,2.97 7.77,2.97 7.77,22.02 ; 50.55,41.07 50.55,51.49 47.8,54.23 43.39,54.23 ; 50.55,41.07 69.6,41.07 ; 50.55,41.07 31.5,41.07 ; 62.44,54.23 66.85,54.23 69.6,51.49 69.6,41.07 ; 31.5,22.02 7.77,22.02 ; 31.5,22.02 50.55,22.02 ; 31.5,22.02 31.5,32.44 28.75,35.18 24.34,35.18 ; 7.77,22.02 7.77,41.07 ; 81.49,35.18 85.9,35.18 88.65,32.44 88.65,22.02 69.6,22.02 ; 81.49,16.13 85.9,16.13 88.65,13.39 88.65,2.97 69.6,2.97 ; 7.77,41.07 7.77,57.6 29.46,79.3 41.66,79.3 48.64,86.28 61.73,86.28 v1(61.73,89.59) ; 7.77,41.07 31.5,41.07 ; 50.55,22.02 69.6,22.02 ; 50.55,22.02 50.55,32.44 47.8,35.18 43.39,35.18 ; 50.55,2.97 69.6,2.97 ; 50.55,2.97 50.55,13.39 47.8,16.13 43.39,16.13 ; 69.6,22.02 69.6,32.44 66.85,35.18 62.44,35.18 ; 62.44,16.13 66.85,16.13 69.6,13.39 69.6,2.97 ; 69.6,41.07 88.65,41.07 88.65,51.49 85.9,54.23 81.49,54.23 ; 24.34,54.23 28.75,54.23 31.5,51.49 31.5,41.07 ; v1(52.6,92.48) v1(57.4,92.48)
GND: length 14.9
  Top Layer w0.254: U1.23 53.84,74.35 51.23,74.35 v1(51.02,74.13) ; v1(49.11,72.23) 48.29,72.23 47.53,71.46 ; v1(49.11,77.94) 49.76,77.94 U1.35 ; v1(47.21,74.13) 47.21,74.61 U1.47 43.72,78.09 v1(43.05,78.09)
  vias: v1(15.05,45.47) v1(15.05,26.42) v1(15.05,7.37) v1(18.5,55.89) v1(18.5,36.83) v1(18.5,17.78) v1(23.44,97.57) v1(24.8,94.76) v1(28.76,44.07) v1(28.76,25.02) v1(28.76,5.97) v1(29.02,97.57) v1(30.38,94.76) v1(32.59,72.2) v1(34.01,68) v1(34.1,45.47) v1(34.1,26.42) v1(34.1,7.37) v1(34.6,97.57) v1(34.71,69.86) v1(34.66,66.41) v1(35.85,65.22) v1(35.95,94.76) v1(35.96,76.13) v1(35.96,73.58) v1(36.56,70.66) v1(37.05,64.02) v1(37.55,55.89) v1(37.55,36.83) v1(37.55,17.78) v1(37.77,70.48) v1(38.23,72.69) v1(38.27,62.8) v1(38.91,71.29) v1(39.47,61.6) v1(41.13,60.98) v1(42.91,61.71) v1(43.68,63.53) v1(44.34,65.86) v1(46.23,68.06) v1(47.81,44.07) v1(47.81,25.02) v1(47.81,5.97) v1(50.63,82.83) v1(51.02,72.23) v1(51.8,92.48) v1(52.87,88.43) v1(53.15,45.47) v1(53.15,26.42) v1(53.15,7.37) v1(55.5,77.65) v1(55.63,79.05) v1(56.51,77.39) v1(56.63,88.43) v1(56.6,55.89) v1(56.6,36.83) v1(56.6,17.78) v1(57.02,74.41) v1(57.06,79.05) v1(57.4,78.28) v1(57.98,83.49) v1(58.2,92.48) v1(59.18,77.84) v1(60.33,83.24) v1(60.78,87.57) v1(63.13,89.59) v1(66.86,44.07) v1(66.86,25.02) v1(66.86,5.97) v1(67.94,78.22) v1(72.2,45.47) v1(72.2,26.42) v1(72.2,7.37) v1(75.65,55.89) v1(75.65,36.83) v1(75.65,17.78) v1(85.91,44.07) v1(85.91,25.02) v1(85.91,5.97)
BOOT0: length 50.5
  Top Layer w0.254: 83.33,97.97 81.66,97.97 80.14,96.44 80.14,88.95 72.14,80.95 v1(65.66,80.95) ; 46.46,77.47 v1(47.43,76.5)
  Bottom Layer w0.254: v1(65.66,80.95) 64.9,80.19 54.86,80.19 51.18,76.5 v1(47.43,76.5)
BOOT1: length 41.4
  Top Layer w0.254: 53.54,72.53 v1(52.57,73.5) ; 83.33,90.6 83.33,90.57 72.56,79.81 v1(65.66,79.81)
  Bottom Layer w0.254: v1(52.57,73.5) 52.57,77.25 55.12,79.81 v1(65.66,79.81)
D+: length 17.6
  Top Layer w0.254: U16.A6 55.25,93.4 55,93.65 54.5,93.65 54.25,93.4 U16.B6 54.25,91.48 54.3,91.43 54.3,81.06 52.12,78.89
D-: length 17.5
  Top Layer w0.254: 54.75,91.56 54.75,91.48 54.7,91.43 54.7,89.89 54.99,89.6 54.99,88.87 54.7,88.59 54.7,87.86 54.99,87.57 54.99,86.84 54.7,86.55 54.7,80.76 52.47,78.54 ; 54.75,91.56 U16.A7 ; 54.75,91.56 55,91.31 55.5,91.31 55.75,91.56 U16.B7
I2C1_SCL: length 34.6
  Top Layer w0.254: U1.43 44.71,79.93 24.73,79.93 16.5,88.17
I2C1_SDA: length 32.3
  Top Layer w0.254: U1.42 45.01,80.34 26.87,80.34 H2.4
OSC32_IN: length 10.3
  Top Layer w0.254: U1.3 44.97,72.44 44.07,72.44 40.38,76.13 C1.2
OSC32_OUT: length 10.2
  Top Layer w0.254: 46.11,72.88 45.23,72 44.77,72 44.51,71.74 44,71.74 43.75,72 43.12,72 42.85,71.73 42.24,71.73 40.39,73.58 X1.1 C2.2
OSC_IN: length 11.4
  Top Layer w0.254: 37.13,67.53 C3.2 44.24,70.3 46.46,72.53
OSC_OUT: length 11.4
  Top Layer w0.254: U1.6 44.2,69.55 44.2,69.14 43.75,68.69 43.34,68.69 42.8,68.15 42.8,67.41 43.35,66.85 X2.2
PA0: length 42.1
  Top Layer w0.254: v1(28.76,48.01) 28.76,57.39 31.5,60.12 46.35,60.12 47.37,61.14 47.37,69.9 U1.10
  Bottom Layer w0.254: v1(28.76,48.01) C5.2
PA1: length 26.1
  Top Layer w0.254: v1(47.81,48.01) 48.85,49.05 48.85,60.17 47.88,61.14 47.88,69.7 U1.11
  Bottom Layer w0.254: v1(47.81,48.01) C9.2
PA2: length 40.9
  Top Layer w0.254: v1(66.86,48.01) 66.86,57.39 64.13,60.12 49.66,60.12 48.39,61.39 48.39,69.5 U1.12
  Bottom Layer w0.254: v1(66.86,48.01) C17.2
PA3: length 52
  Top Layer w0.254: U1.13 60.48,60.63 82.68,60.63 85.91,57.39 v1(85.91,48.01)
  Bottom Layer w0.254: v1(85.91,48.01) C20.2
PA4: length 129.1
  Top Layer w0.254: U1.14 60.68,61.14 85.09,61.14 87.63,58.6 87.63,43.99 86.23,42.6 32.51,42.6 28.76,38.85 v1(28.76,28.96)
  Bottom Layer w0.254: v1(28.76,28.96) C6.2
PA5: length 111.1
  Top Layer w0.254: U1.15 60.88,61.65 85.34,61.65 88.14,58.85 88.14,43.87 86.36,42.09 51.05,42.09 47.81,38.85 v1(47.81,28.96)
  Bottom Layer w0.254: v1(47.81,28.96) C10.2
PA6: length 93.1
  Top Layer w0.254: 52.12,71.11 61.08,62.15 85.6,62.15 88.65,59.11 88.65,43.74 86.49,41.58 69.6,41.58 66.86,38.85 v1(66.86,28.96)
  Bottom Layer w0.254: v1(66.86,28.96) C18.2
PA7: length 76
  Top Layer w0.254: 52.47,71.46 61.28,62.66 85.85,62.66 89.15,59.36 89.15,43.61 85.91,40.37 v1(85.91,28.96)
  Bottom Layer w0.254: v1(85.91,28.96) C21.2
PA8: length 65.4
  Top Layer w0.254: v1(56.51,78.28) 54.34,78.28 53.54,77.47
  Bottom Layer w0.254: 16.26,54.23 14.99,55.5 14.99,57.84 16.26,59.11 44.96,59.11 58.17,72.31 58.17,76.63 v1(56.51,78.28) ; 16.38,54.23 18.5,54.23
PB0: length 150.8
  Top Layer w0.254: U1.18 61.48,63.17 86.11,63.17 89.66,59.61 89.66,26.97 86.23,23.55 32.51,23.55 28.76,19.8 v1(28.76,9.91)
  Bottom Layer w0.254: v1(28.76,9.91) C7.2
PB1: length 132.8
  Top Layer w0.254: U1.19 61.68,63.68 86.36,63.68 90.17,59.87 90.17,26.85 86.36,23.04 51.05,23.04 47.81,19.8 v1(47.81,9.91)
  Bottom Layer w0.254: v1(47.81,9.91) C11.2
PB3: length 22.7
  Top Layer w0.254: U1.39 45.64,81.84 39.62,81.84 38.3,83.16 SW2.3 38.3,92.42 v1(36.94,93.77)
PB4: length 28.4
  Top Layer w0.254: v1(31.37,93.77) 32.72,92.42 SW3.3 32.72,82.65 34.04,81.33 45.44,81.33 47.88,78.89
PB5: length 34.1
  Top Layer w0.254: v1(25.79,93.77) 27.14,92.42 SW4.3 27.14,82.13 28.45,80.82 45.24,80.82 47.53,78.54
PB10: length 114.6
  Top Layer w0.254: v1(66.86,9.91) 66.86,19.8 69.6,22.53 86.49,22.53 90.68,26.72 90.68,60.12 86.61,64.19 62.58,64.19 53.89,72.88
  Bottom Layer w0.254: v1(66.86,9.91) C19.2
PB11: length 97.5
  Top Layer w0.254: U1.22 62.78,64.69 86.87,64.69 91.19,60.38 91.19,26.59 85.91,21.32 v1(85.91,9.91)
  Bottom Layer w0.254: v1(85.91,9.91) C22.2
PC13: length 15.1
  Top Layer w0.254: R5.2 40.71,77.07 43.31,74.47 43.31,73.71 43.94,73.08 44.89,73.08 U1.2
RESET: length 18
  Top Layer w0.254: U1.7 50.33,74.98 54.99,74.98 56.45,76.44 C23.2 R4.1 61.34,74.52
SWCLK: length 9.3
  Top Layer w0.254: U1.37 43.44,85.45 H1.3
SWDIO: length 14.2
  Top Layer w0.254: 45.24,88.78 46.78,88.78 53.09,82.48 53.09,80.56 U1.34
USART1_RX: length 28.7
  Top Layer w0.254: U1.31 54.83,80.19 55.59,80.19 55.77,80.37 55.77,80.39 55.95,80.57 56.6,80.57 56.78,80.39 56.78,80.37 56.96,80.19 57.62,80.19 57.8,80.37 57.8,80.39 57.98,80.57 58.64,80.57 58.82,80.39 58.82,80.37 59,80.19 59.65,80.19 59.83,80.37 59.83,80.39 60.01,80.57 60.67,80.57 60.85,80.39 60.85,80.37 61.03,80.19 63.25,80.19 72.01,88.95 U11.6
USART1_TX: length 28.9
  Top Layer w0.254: U1.30 55.13,79.78 63.41,79.78 74.55,90.92 U11.4
$1N2502: length 1.8
  Top Layer w0.254: R5.1 32.59,73.8
$1N8138: length 2.4
  Top Layer w0.254: R2.2 84.84,95.56
$1N8141: length 2.4
  Top Layer w0.254: U15.4 R3.1
$1N12765: length 1.7
  Top Layer w0.254: LED1.2 R1.1
$1N28341: length 2.7
  Top Layer w0.254: U16.A5 56.25,90.32 R6.2
$1N28394: length 2.7
  Top Layer w0.254: U16.B5 53.25,90.32 R7.1
$1N31642: length 13.9
  Bottom Layer w0.254: 24.34,55.89 30.15,55.89 31.8,54.23 37.55,54.23
$1N31651: length 13.9
  Bottom Layer w0.254: 43.39,55.89 49.19,55.89 50.85,54.23 56.6,54.23
$1N31657: length 13.9
  Bottom Layer w0.254: 75.65,54.23 69.9,54.23 68.25,55.89 62.44,55.89
$1N31663: length 13.9
  Bottom Layer w0.254: 24.34,36.83 30.15,36.83 31.8,35.18 37.55,35.18
$1N31669: length 13.9
  Bottom Layer w0.254: 43.39,36.83 49.19,36.83 50.85,35.18 56.6,35.18
$1N31675: length 13.9
  Bottom Layer w0.254: 75.65,35.18 69.9,35.18 68.25,36.83 62.44,36.83
$1N31681: length 13.9
  Bottom Layer w0.254: 24.34,17.78 30.15,17.78 31.8,16.13 37.55,16.13
$1N31687: length 13.9
  Bottom Layer w0.254: 56.6,16.13 50.85,16.13 49.19,17.78 43.39,17.78
$1N31693: length 13.9
  Bottom Layer w0.254: 62.44,17.78 68.25,17.78 69.9,16.13 75.65,16.13
$1N32081: length 113
  Bottom Layer w0.254: 18.5,35.18 13.97,35.18 12.7,36.45 12.7,38.15 13.97,39.42 90.17,39.42 92.33,41.58 92.33,53.73 90.17,55.89 81.49,55.89
$1N32103: length 113
  Bottom Layer w0.254: 81.49,36.83 90.17,36.83 92.33,34.68 92.33,22.53 90.17,20.37 13.97,20.37 12.7,19.1 12.7,17.4 13.97,16.13 18.5,16.13

## Copper pours and planes (outline as drawn; the poured copper is in the pictures)
GND on Top Layer: 0,100 100,100 100,0 0,0
GND on Bottom Layer: 0,100 100,100 100,0 0,0

Small or netless copper shapes (teardrops, artwork), in the pictures only: 145 on Top Layer, 106 on Bottom Layer

## Text on the board
Top Silkscreen Layer: GND | 3V3 | SCL | SDA | SET | 1 | 2 | WORK | 3 | POWER | RST | RX | TX | 0 | BOOT | CLK | DIO | Designed By Achan Wang | Mini-Keyboard

# Board PCB2
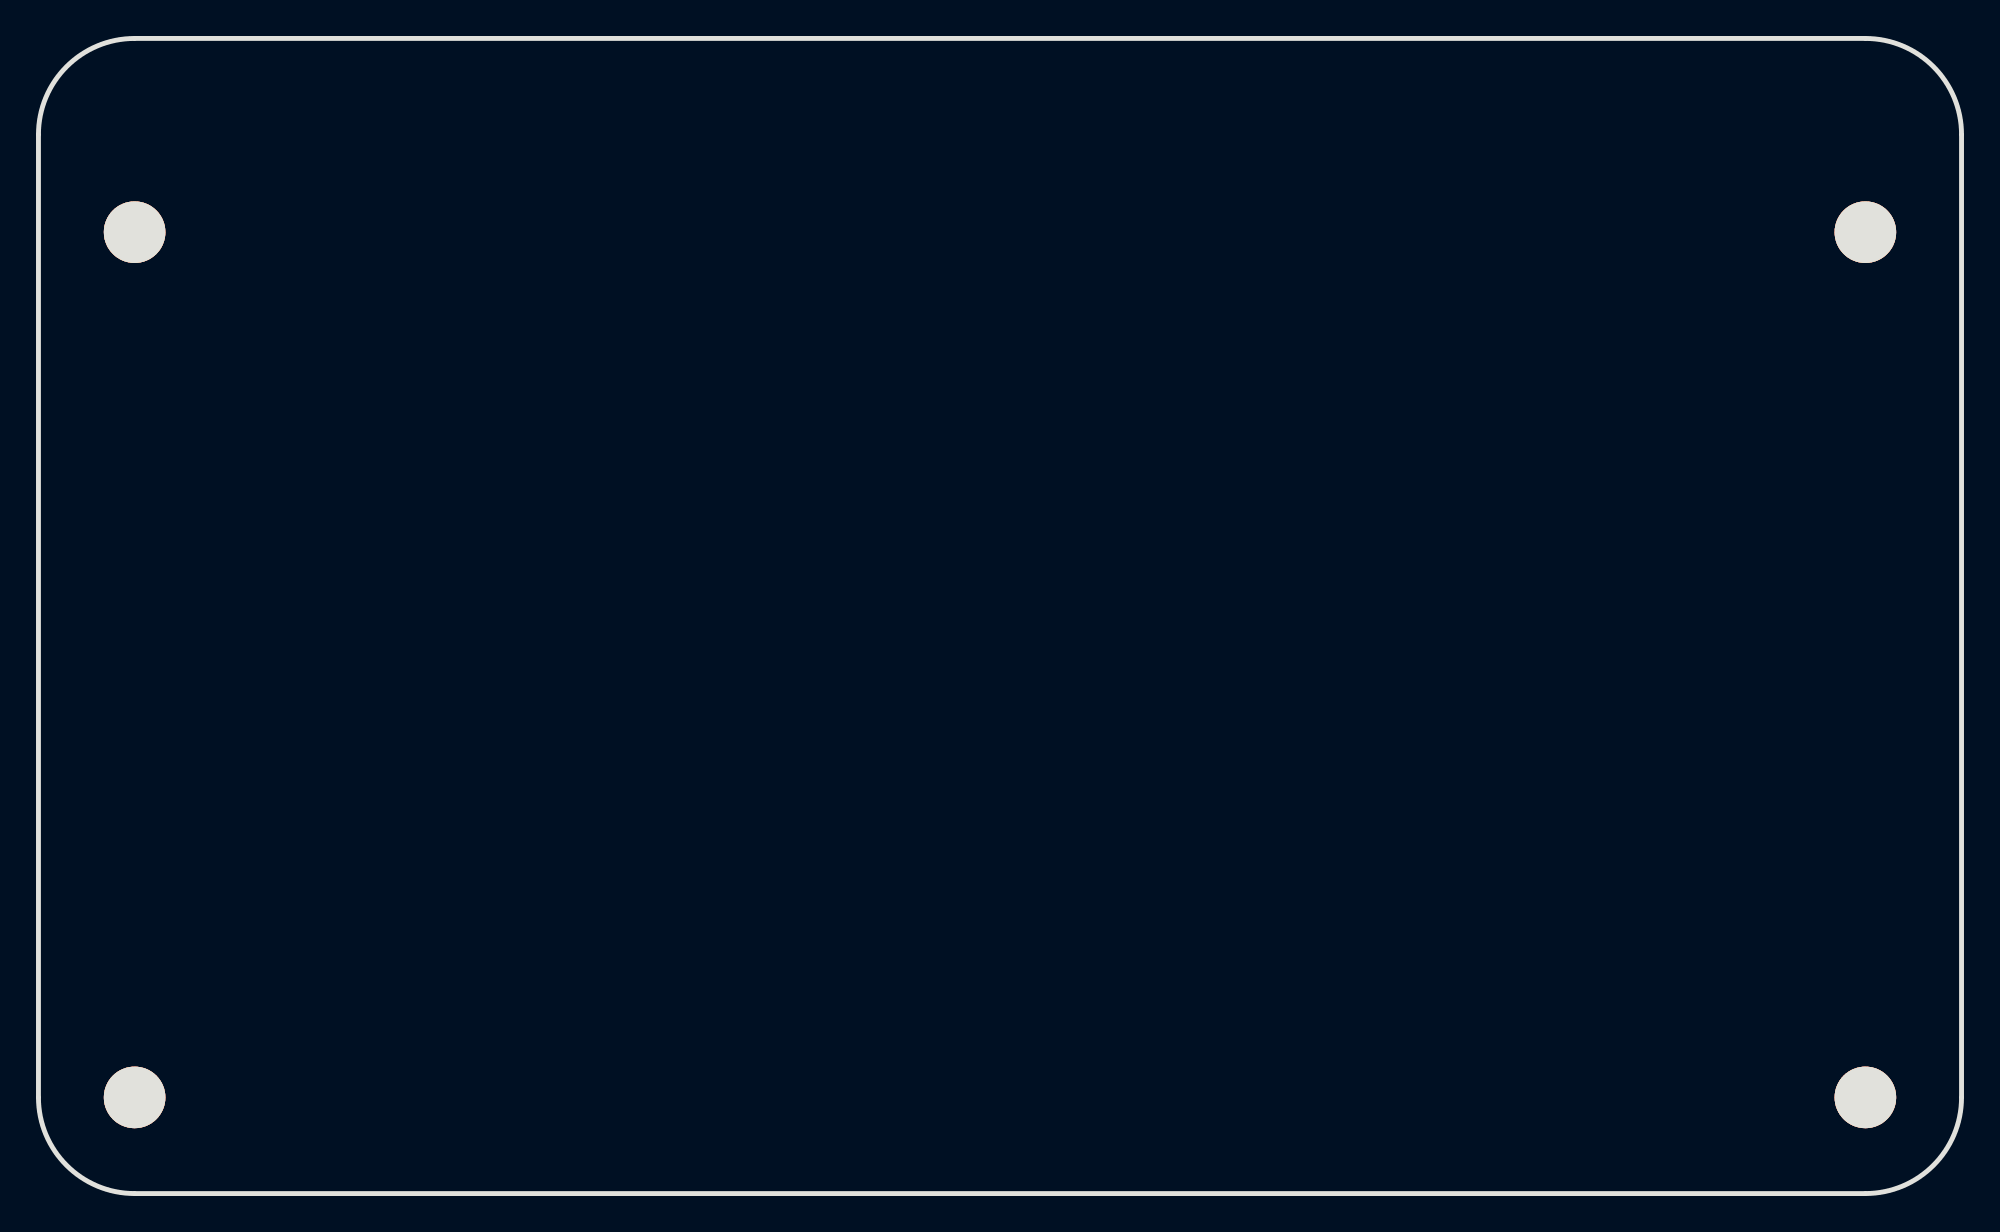
[diagram p3: board, top side]
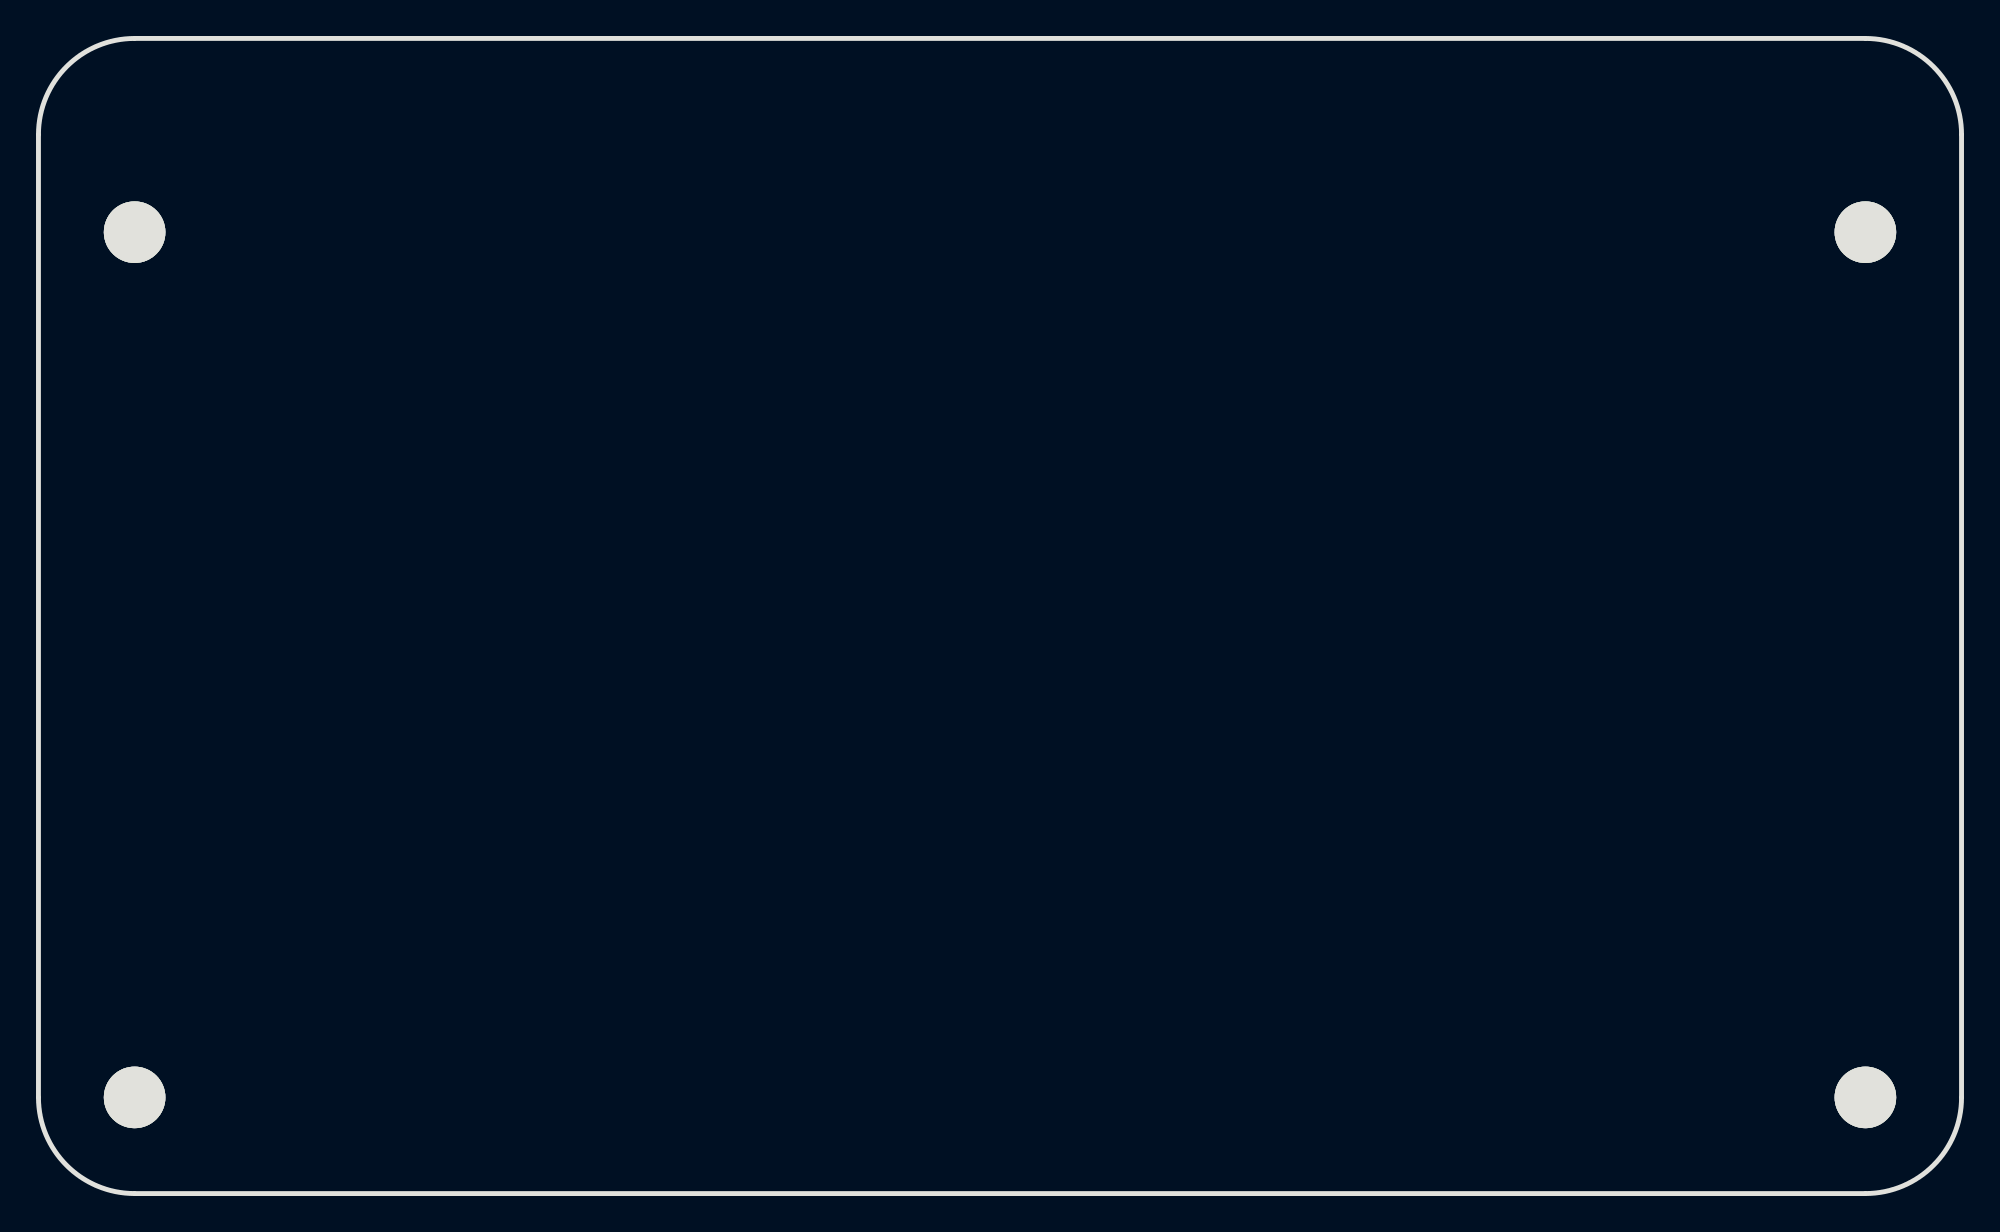
[diagram p4: board, bottom side, seen from below]

Outline 100 x 60.08 mm; copper layers: Top Layer, Bottom Layer. Coordinates in mm from the lower left corner of the outline.
Outline path: 0,55.08 0,5 arc(1.46,1.46) 5,0 95,0 arc(98.54,1.46) 100,5 100,55.08 arc(98.54,58.61) 95,60.08 5,60.08 arc(1.46,58.61) 0,55.08
Stack: Top Layer 0.035mm / Dielectric1 1.51mm FR4 er 4.5 / Bottom Layer 0.035mm

## Design rules (mm)
template: JLCPCB Capability(Two Layers Board)
spacing copperThickness1oz (default): track to track 0.102, other pairs 0.152 to 0.3
spacing copperThickness2oz: track to track 0.203, other pairs 0.152 to 0.3
track width copperThickness1oz (default): min 0.127, default 0.254, max 2.54
track width copperThickness2oz: min 0.203, default 0.254, max 2.54
differential pair differentialPair (default): width min 0.127, default 0.254, max 2.54; gap min 0.152, default 0.152
via viaSize (default): diameter min 0.5, default 0.61, max 10; hole min 0.3, default 0.305, max 6.3

## Placement (name value [footprint] x y rotation side)
TP2  -  [M3螺丝]  5.06 49.94 0 top
TP3  -  [M3螺丝]  5.06 4.94 0 top
TP4  -  [M3螺丝]  95.06 4.94 0 top
TP5  -  [M3螺丝]  95.06 49.94 0 top

## Footprints (pads in the part's own frame, mm; a bottom-side part is the same pattern mirrored in y, then rotated)
M3螺丝
  round 3.2 hole 3.2: 1(-0.064,0.064)

## Nets

Pads without a net: TP2 1; TP3 1; TP4 1; TP5 1
